# EAGLE design walrus (EAGLE 7.6.0)
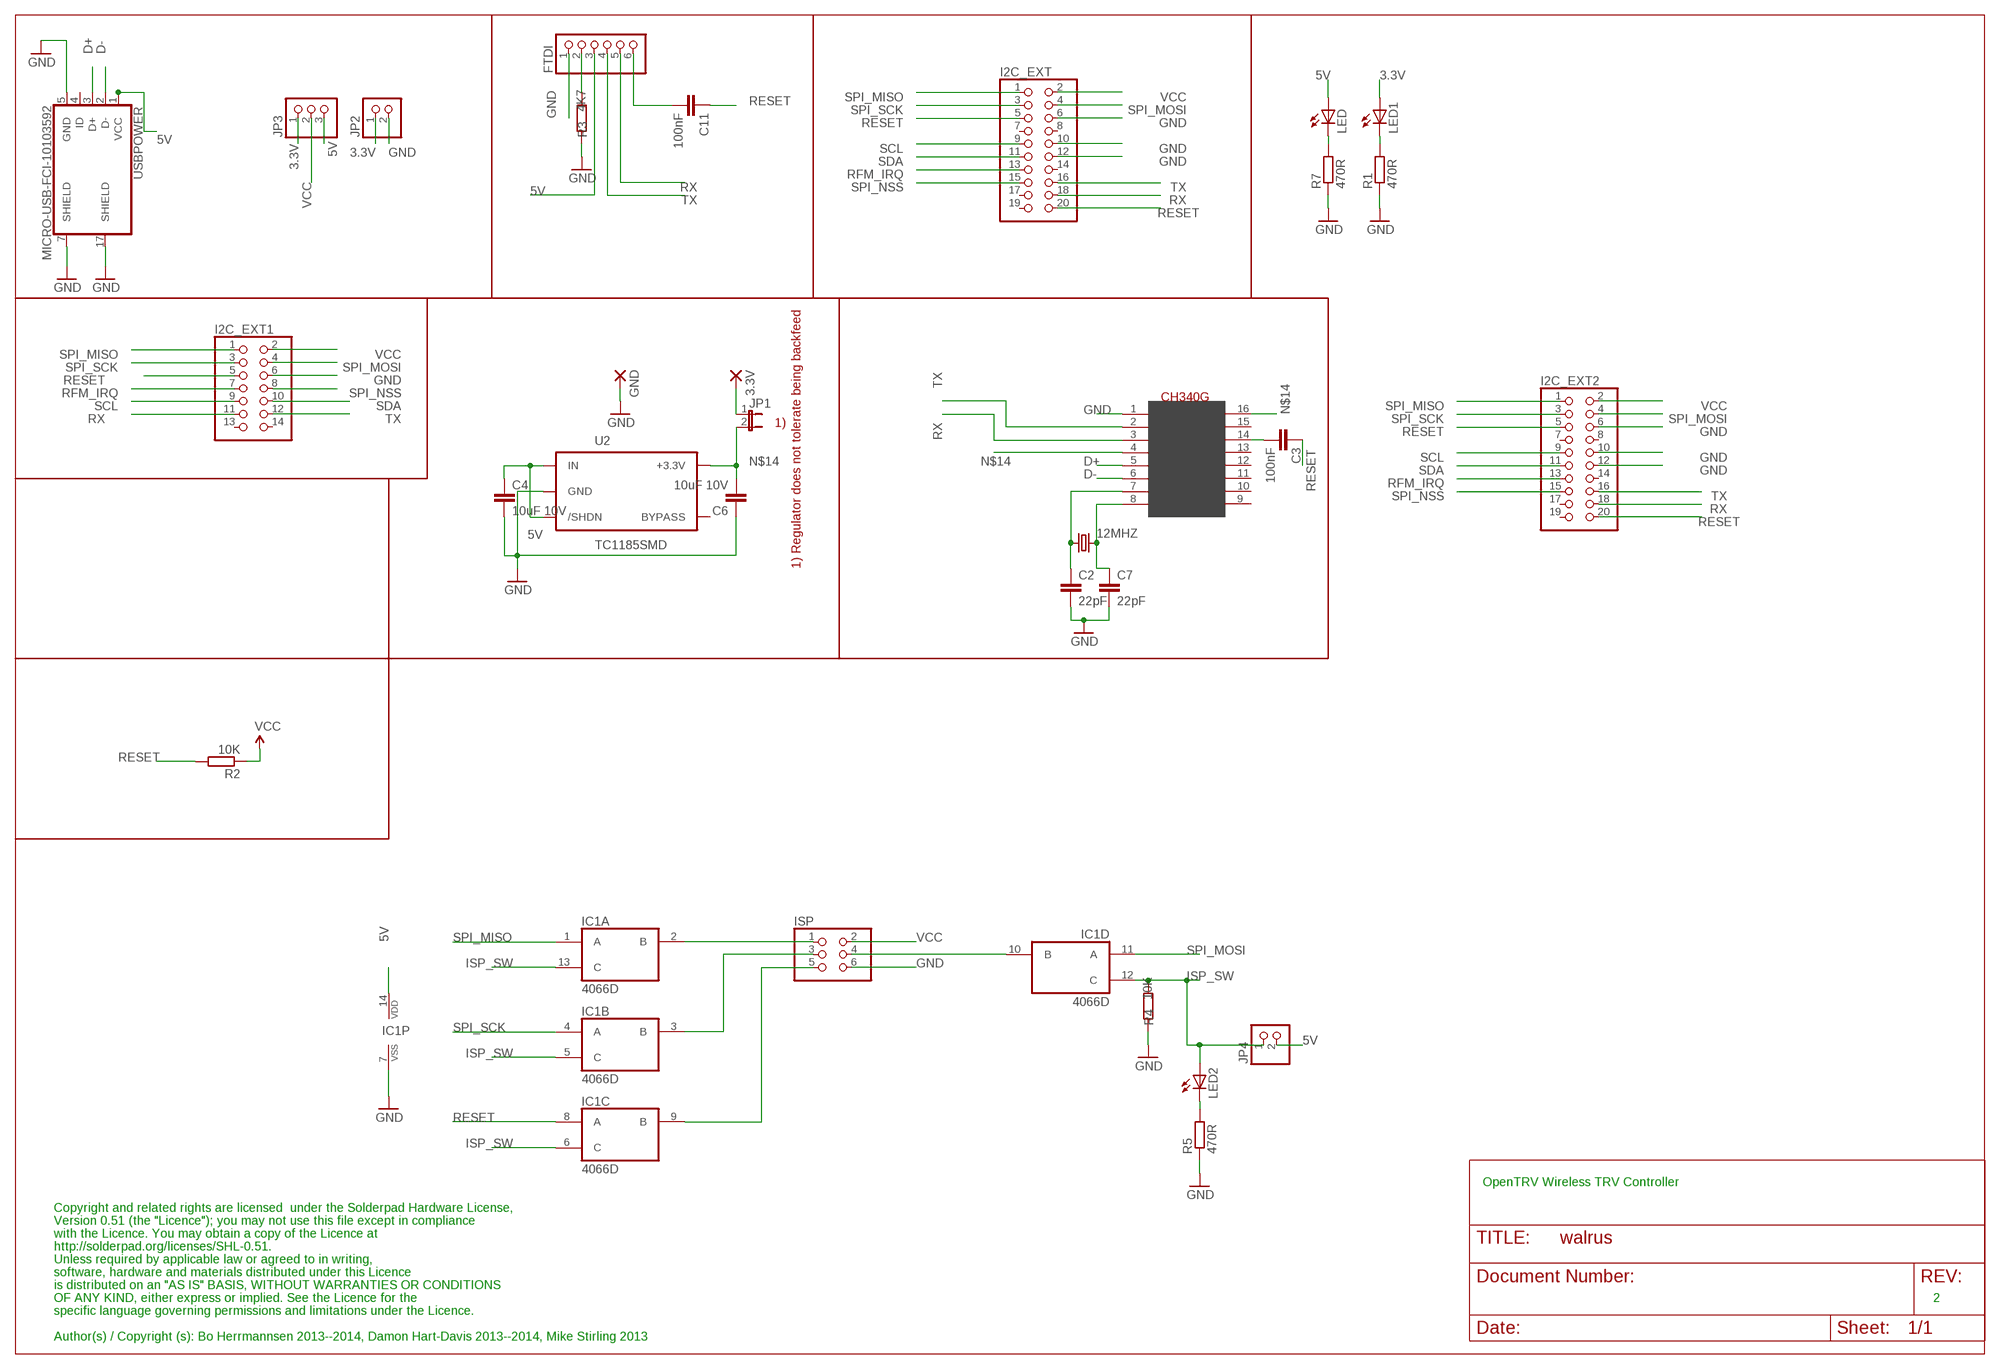
[diagram p0: schematic, sheet 1]

## Parts
3.3V  3,81/1,4  [3,81/1,4]
12MHZ  CRYSTALHC18U-V  [HC18U-V]
C2  22pF  C-EUC0603  [C0603]
C3  100nF  CAP0603-CAP  [0603-CAP]
C4  10uF 10V  CAP0603-CAP  [0603-CAP]
C6  10uF 10V  CAP0603-CAP  [0603-CAP]
C7  22pF  C-EUC0603  [C0603]
C11  100nF  CAP0603-CAP  [0603-CAP]
FTDI  PINHD-1X6/90  [1X06/90]
GND  3,81/1,4  [3,81/1,4]
I2C_EXT  PINHD-2X10  [2X10]
I2C_EXT1  PINHD-2X7  [2X07]
I2C_EXT2  PINHD-2X10  [2X10]
IC1  4066D  [SO14]
ISP  PINHD-2X3  [2X03]
JP1  JP1E  [JP1]
JP2  PINHD-1X2  [1X02]
JP3  PINHD-1X3  [1X03]
JP4  PINHD-1X2  [1X02]
LED  LEDCHIP-LED0603  [CHIP-LED0603]
LED1  LEDCHIP-LED0603  [CHIP-LED0603]
LED2  LEDCHIP-LED0603  [CHIP-LED0603]
R1  470R  R-EU_R0603  [R0603]
R2  10K  R-EU_R0603  [R0603]
R3  4K7  R-EU_R0603  [R0603]
R4  10K  R-EU_R0603  [R0603]
R5  470R  R-EU_R0603  [R0603]
R7  470R  R-EU_R0603  [R0603]
U2  TC1185SMD  [TC1185]
U$3  CH340G  [SOIC16]
USBPOWER  MICRO-USB-FCI-10103592  [MICRO-USB-FCI-10103592]

## Nets
3.3V [supply]: 3.3V.1(P) JP1.1 JP2.1 JP3.1 LED1.A
5V [supply]: C4.1 FTDI.3 IC1.14(P:VDD) JP3.3 JP4.2 LED.A U2.1(IN) U2.3(/SHDN) USBPOWER.1(VCC)
D+: U$3.5(D+) USBPOWER.3(D+)
D-: U$3.6(D-) USBPOWER.2(D-)
GND [supply]: C2.2 C4.2 C6.1 C7.2 FTDI.1 GND.1(P) I2C_EXT1.6 I2C_EXT2.6 I2C_EXT2.10 I2C_EXT2.12 I2C_EXT.6 I2C_EXT.10 I2C_EXT.12 IC1.7(P:VSS) ISP.6 JP2.2 R1.1 R3.1 R4.1 R5.1 R7.1 U2.2(GND) U$3.1(GND) USBPOWER.5(GND) USBPOWER.7(SHIELD) USBPOWER.17(SHIELD)
ISP_SW: IC1.5(B:C) IC1.6(C:C) IC1.12(D:C) IC1.13(A:C) JP4.1 LED2.A R4.2
N$1: C11.2 FTDI.6
N$3: C3.2 U$3.14(RTS)
N$5: FTDI.2 R3.2
N$6: IC1.2(A:B) ISP.1
N$7: LED1.C R1.2
N$8: 12MHZ.1 C2.1 U$3.7(XI)
N$11: IC1.3(B:B) ISP.3
N$13: LED.C R7.2
N$14 [supply]: C6.2 JP1.2 U2.5(+3.3V) U$3.4(V3) U$3.16(VCC)
N$15: 12MHZ.2 C7.1 U$3.8(XO)
N$17: IC1.9(C:B) ISP.5
N$20: IC1.10(D:B) ISP.4
N$21: LED2.C R5.2
RESET: C3.1 C11.1 I2C_EXT1.5 I2C_EXT2.5 I2C_EXT2.20 I2C_EXT.5 I2C_EXT.20 IC1.8(C:A) R2.2
RFM_IRQ: I2C_EXT1.7 I2C_EXT2.13 I2C_EXT.13
RX: FTDI.5 I2C_EXT1.11 I2C_EXT2.18 I2C_EXT.18 U$3.3(RX)
SCL: I2C_EXT1.9 I2C_EXT2.9 I2C_EXT.9
SDA: I2C_EXT1.10 I2C_EXT2.11 I2C_EXT.11
SPI_MISO: I2C_EXT1.1 I2C_EXT2.1 I2C_EXT.1 IC1.1(A:A)
SPI_MOSI: I2C_EXT1.4 I2C_EXT2.4 I2C_EXT.4 IC1.11(D:A)
SPI_NSS: I2C_EXT1.8 I2C_EXT2.15 I2C_EXT.15
SPI_SCK: I2C_EXT1.3 I2C_EXT2.3 I2C_EXT.3 IC1.4(B:A)
TX: FTDI.4 I2C_EXT1.12 I2C_EXT2.16 I2C_EXT.16 U$3.2(TX)
VCC [supply]: I2C_EXT1.2 I2C_EXT2.2 I2C_EXT.2 ISP.2 JP3.2 R2.1
Unconnected: I2C_EXT1.13 I2C_EXT1.14 I2C_EXT2.7 I2C_EXT2.8 I2C_EXT2.14 I2C_EXT2.17 I2C_EXT2.19 I2C_EXT.7 I2C_EXT.8 I2C_EXT.14 I2C_EXT.17 I2C_EXT.19 U2.4(BYPASS) U$3.9(CTS) U$3.10(DSR) U$3.11(RI) U$3.12(DCD) U$3.13(DTR) U$3.15(RS232) USBPOWER.4(ID)

## Notes on the sheet
- 1)
- 1) Regulator does not tolerate being backfeed
- OpenTRV Wireless TRV Controller
- Copyright and related rights are licensed  under the Solderpad Hardware License,
- Version 0.51 (the "Licence"); you may not use this file except in compliance
- with the Licence. You may obtain a copy of the Licence at
- http://solderpad.org/licenses/SHL-0.51.
- Unless required by applicable law or agreed to in writing,
- software, hardware and materials distributed under this Licence
- is distributed on an "AS IS" BASIS, WITHOUT WARRANTIES OR CONDITIONS
- OF ANY KIND, either express or implied. See the Licence for the | 2
- specific language governing permissions and limitations under the Licence.
- Author(s) / Copyright (s): Bo Herrmannsen 2013--2014, Damon Hart-Davis 2013--2014, Mike Stirling 2013

## Library data of the parts
3.3V GND = wirepad:3,81/1,4: THROUGH-HOLE PAD
12MHZ = crystal:CRYSTAL: CRYSTAL; OC_FARNELL: unknown; OC_NEWARK: unknown
C2 C7 = resistor:C-EU: CAPACITOR, European symbol
C3 C4 C6 C11 = SparkFun-Passives:CAP: Capacitor Standard 0603 ceramic capacitor, and 0.1" leaded capacitor.
FTDI = pinhead:PINHD-1X6: PIN HEADER
I2C_EXT I2C_EXT2 = pinhead:PINHD-2X10: PIN HEADER
I2C_EXT1 = pinhead:PINHD-2X7: PIN HEADER
IC1 = 40xx:4066: Quad bilateral ANALOG SWITCH
ISP = pinhead:PINHD-2X3: PIN HEADER
JP1 = jumper:JP1E: JUMPER
JP2 JP4 = pinhead:PINHD-1X2: PIN HEADER
JP3 = pinhead:PINHD-1X3: PIN HEADER
LED LED1 LED2 = led:LED: LED OSRAM: - CHIPLED LG R971, LG N971, LY N971, LG Q971, LY Q971, LO R971, LY R971 LH N974, LH R974 LS Q976, LO Q976, LY Q976 LO Q996 - Hyper CHIPLED LW Q18S LB Q993, LB Q99A, LB R99A - SideLED LS A670, LO A670, LY A670, LG A670, LP A670 LB A673, LV A673, LT A673, LW A673 LH A674 LY A675 LS A676, LA A676, LO A676, LY A676, LW A676 LS A679, LY A679, LG A679 - Hyper Micro SIDELED® LS Y876, LA Y876, LO Y876, LY Y876 LT Y87S - SmartLED LW L88C, LW L88S LB L89C, LB L89S, LG L890 LS L89K, LO L89K, LY L89K LS L896, LA L896, LO L896, LY L896 - TOPLED LS T670, LO T670, LY T670, LG T670, LP T670 LSG T670, LSP T670, LSY T670, LOP T670, LYG T670 LG T671, LOG T671, LSG T671 LB T673, LV T673, LT T673, LW T673 LH T674 LS T676, LA T676, LO T676, LY T676, LB T676, LH T676, LSB T676, LW T676 LB T67C, LV T67C, LT T67C, LS T67K, LO T67K, LY T67K, LW E67C LS E67B, LA E67B, LO E67B, LY E67B, LB E67C, LV E67C, LT E67C LW T67C LS T679, LY T679, LG T679 LS T770, LO T770, LY T770, LG T770, LP T770 LB T773, LV T773, LT T773, LW T773 LH T774 LS E675, LA E675, LY E675, LS T675 LS T776, LA T776, LO T776, LY T776, LB T776 LHGB T686 LT T68C, LB T68C - Hyper Mini TOPLED® LB M676 - Mini TOPLED Santana® LG M470 LS M47K, LO M47K, LY M47K Source: http://www.osram.convergy.de LUXEON: - LUMILED® LXK2-PW12-R00, LXK2-PW12-S00, LXK2-PW14-U00, LXK2-PW14-V00 LXK2-PM12-R00, LXK2-PM12-S00, LXK2-PM14-U00 LXK2-PE12-Q00, LXK2-PE12-R00, LXK2-PE12-S00, LXK2-PE14-T00, LXK2-PE14-U00 LXK2-PB12-K00, LXK2-PB12-L00, LXK2-PB12-M00, LXK2-PB14-N00, LXK2-PB14-P00, LXK2-PB14-Q00 LXK2-PR12-L00, LXK2-PR12-M00, LXK2-PR14-Q00, LXK2-PR14-R00 LXK2-PD12-Q00, LXK2-PD12-R00, LXK2-PD12-S00 LXK2-PH12-R00, LXK2-PH12-S00 LXK2-PL12-P00, LXK2-PL12-Q00, LXK2-PL12-R00 Source: www.luxeon.com KINGBRIGHT: KA-3528ASYC Source: www.kingbright.com
R1-R5 R7 = resistor:R-EU_: RESISTOR, European symbol
U2 = 3.3VREG:TC1185
U$3 = usb-serial:CH340G
USBPOWER = micro-usb-fci-10103592:MICRO-USB-FCI-10103592: Micro USB B Connector RS No: 714-2334 MRF No: 10103592-0001LF

## Net classes
0 default: width 0.203 mm
1 supply: width 0.406 mm, clearance 0.203 mm

## Board
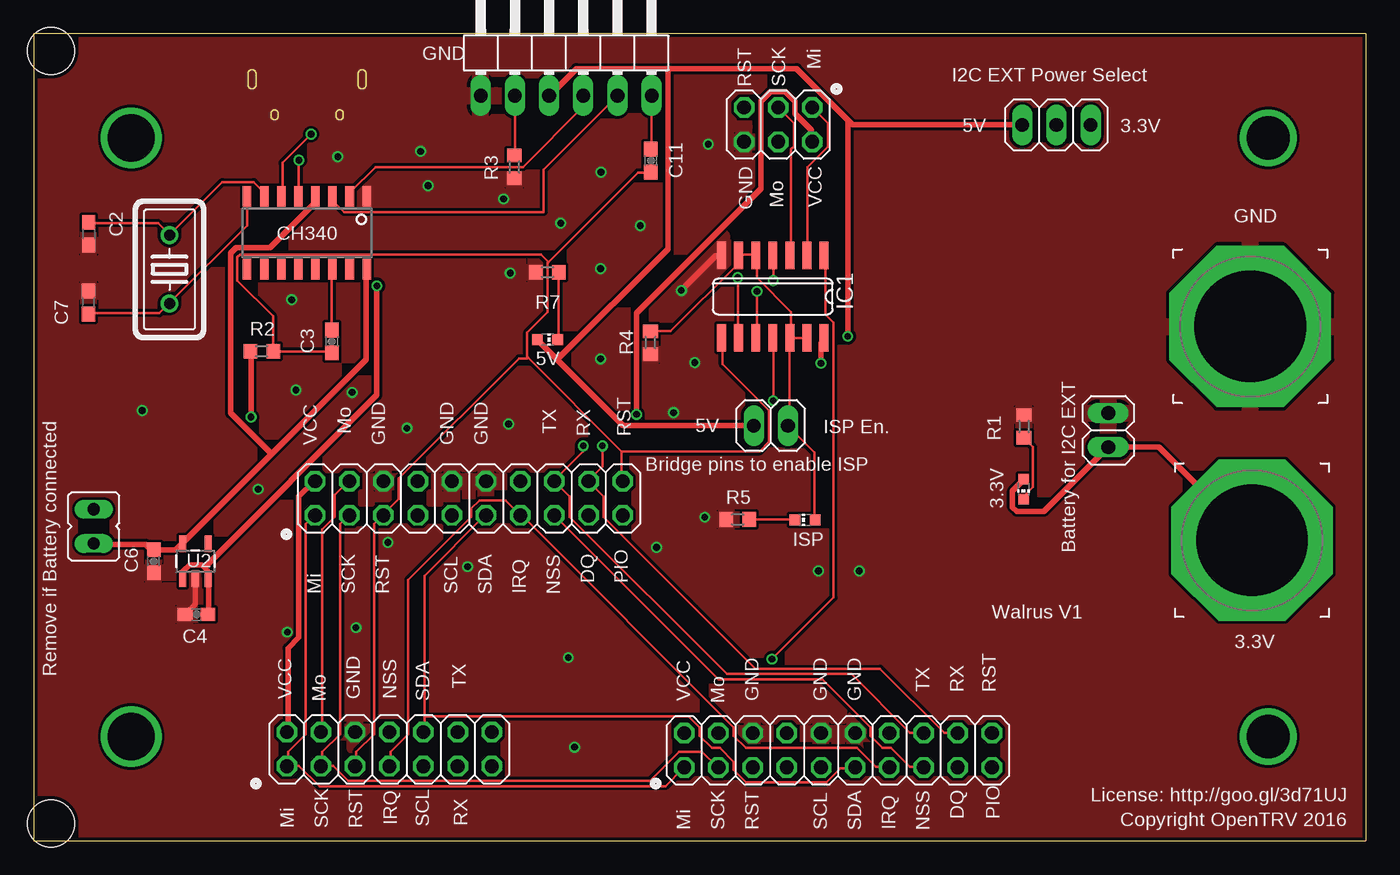
[diagram p1: board, top side]
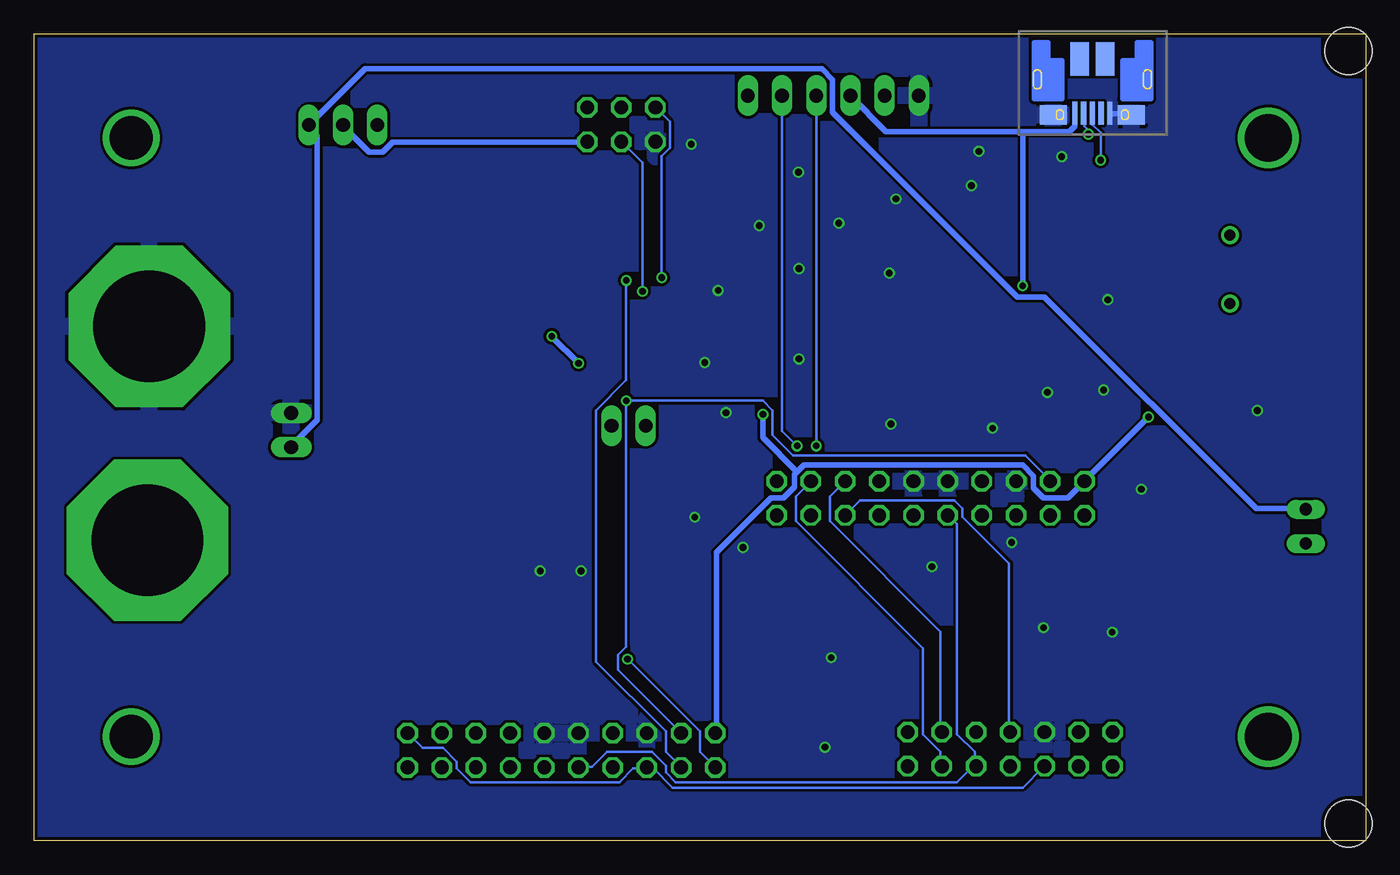
[diagram p2: board, bottom side, seen from below]

Size 99 x 60 mm. Coordinates in mm from the lower left corner, seen from the top.
Outline: 0,0 99,0 99,60 0,60 0,0
Copper layers (1*16): Top 0.035mm / dielectric 1.5mm / Bottom 0.035mm
Design rules "PMServicesStd *": minimum track width 8mil, minimum drill 0.5mm, track to track 8mil, track to pad 8mil, pad to pad 8mil, via to via 8mil, smd to smd 0mil, copper to edge 10mil, drill to drill 10mil, minimum pad ring 10mil, minimum via ring 6mil, stop-mask expansion 2mil, vias tented up to drill 100mil, thermal gap 10mil
Holes 3.5 mm at 1.3,58.7 1.3,1.3

### Footprints (pad centres in the part's own frame; a part is rotated, then mirrored left to right if it is on the bottom)
3,81/1,4 = drill 8.3 pad 12 octagon: 1 0,0
HC18U-V = drill 0.813: 1 -2.54,0; 2 2.54,0
C0603 = smd 1.1 x 1: 1 -0.85,0; 2 0.85,0
0603-CAP = smd 1.1 x 1: 1 -0.85,0; 2 0.85,0
1X06/90 = drill 1.016 long: 1 -6.35,-3.81; 2 -3.81,-3.81; 3 -1.27,-3.81; 4 1.27,-3.81; 5 3.81,-3.81; 6 6.35,-3.81
2X10 = drill 1.016 octagon: 1 -11.43,-1.27; 2 -11.43,1.27; 3 -8.89,-1.27; 4 -8.89,1.27; 5 -6.35,-1.27; 6 -6.35,1.27; 7 -3.81,-1.27; 8 -3.81,1.27; 9 -1.27,-1.27; 10 -1.27,1.27; 11 1.27,-1.27; 12 1.27,1.27; 13 3.81,-1.27; 14 3.81,1.27; 15 6.35,-1.27; 16 6.35,1.27; 17 8.89,-1.27; 18 8.89,1.27; 19 11.43,-1.27; 20 11.43,1.27
2X07 = drill 1.016 octagon: 1 -7.62,-1.27; 2 -7.62,1.27; 3 -5.08,-1.27; 4 -5.08,1.27; 5 -2.54,-1.27; 6 -2.54,1.27; 7 0,-1.27; 8 0,1.27; 9 2.54,-1.27; 10 2.54,1.27; 11 5.08,-1.27; 12 5.08,1.27; 13 7.62,-1.27; 14 7.62,1.27
SO14 = smd 0.66 x 2.032: 1 -3.81,-3.073; 2 -2.54,-3.073; 3 -1.27,-3.073; 4 0,-3.073; 5 1.27,-3.073; 6 2.54,-3.073; 7 3.81,-3.073; 8 3.81,3.073; 9 2.54,3.073; 10 1.27,3.073; 11 0,3.073; 12 -1.27,3.073; 13 -2.54,3.073; 14 -3.81,3.073
2X03 = drill 1.016 octagon: 1 -2.54,-1.27; 2 -2.54,1.27; 3 0,-1.27; 4 0,1.27; 5 2.54,-1.27; 6 2.54,1.27
JP1 = drill 0.914 long: 1 0,-1.27; 2 0,1.27
1X02 = drill 1.016 long: 1 -1.27,0; 2 1.27,0
1X03 = drill 1.016 long: 1 -2.54,0; 2 0,0; 3 2.54,0
CHIP-LED0603 = smd 0.8 x 0.8: A 0,-0.75; C 0,0.75
R0603 = smd 1 x 1.1: 1 -0.85,0; 2 0.85,0
TC1185 = smd 0.55 x 1.2: 1 -0.95,-1.3; 2 0,-1.3; 3 0.95,-1.3; 4 0.95,1.3; 5 -0.95,1.3
SOIC16 = smd 0.635 x 1.524: 1 -4.445,-2.695; 2 -3.175,-2.695; 3 -1.905,-2.695; 4 -0.635,-2.695; 5 0.635,-2.695; 6 1.905,-2.695; 7 3.175,-2.695; 8 4.445,-2.695; 9 4.445,2.695; 10 3.175,2.695; 11 1.905,2.695; 12 0.635,2.695; 13 -0.635,2.695; 14 -1.905,2.695; 15 -3.175,2.695; 16 -4.445,2.695
MICRO-USB-FCI-10103592 = smd 0.4 x 1.71: 1 3.84,2.51; 2 3.19,2.51; 3 2.54,2.51; 4 1.89,2.51; 5 1.24,2.51 | smd 2 x 1.46: 7 -0.36,2.64; 17 5.44,2.64 | smd 1.375 x 2.5: 11 1.603,-1.52; 12 3.478,-1.52

### Placement (x,y rotation side)
3.3V  90.54,22.34 0 top
12MHZ  10.1,42.47 270 top
C2  4.09,45.12 270 top
C3  22.15,37.12 90 top
C4  12.1,16.83 180 top
C6  8.92,20.79 90 top
C7  4.09,40.01 90 top
C11  45.87,50.56 90 top
FTDI  39.57,59.2 0 top
GND  90.41,38.24 0 top
I2C_EXT  59.78,6.74 0 top
I2C_EXT1  26.43,6.82 0 top
I2C_EXT2  32.35,25.46 0 top
IC1  54.93,40.45 180 top
ISP  55.33,53.24 180 top
JP1  4.47,23.37 180 top
JP2  79.86,30.53 90 top
JP3  76.01,53.21 180 top
JP4  54.78,30.87 180 top
LED  38.18,37.26 270 top
LED1  73.56,26.14 180 top
LED2  57.33,23.86 90 top
R1  73.59,30.8 270 top
R2  16.95,36.39 0 top
R3  35.72,50.08 90 top
R4  45.83,37.03 90 top
R5  52.32,23.89 0 top
R7  38.18,42.26 0 top
U2  12.02,20.79 0 top
U$3  20.31,45.19 180 top
USBPOWER  17.79,56.59 180 bottom

### Tracks (layer width: path | path; a pad name or v marks a point on that pad's centre or on a via)
3.3V
  Top 0.406: LED1.A 73.56,26.82 72.75,26.01 72.75,24.79 73.05,24.49 75.08,24.49 JP2.1 80.06,29.26 83.62,29.26 90.53,22.35 3.3V.1
  Bottom 0.406: JP1.1 4.47,24.69 8.13,24.69 23.88,40.44 25.91,40.44 39.62,54.15 39.62,56.59 40.44,57.4 74.37,57.4 78.54,53.24 JP3.1 78.54,53.03 77.93,52.43 77.93,31.29 79.86,29.36 JP2.1
5V  (via drill 0.5)
  Top 0.406: 38.91,35.76 43.79,30.89 53.44,30.89 JP4.2 | 38.91,35.76 37.49,37.19 LED.A | C4.1 13.01,16.87 13.01,19.41 U2.3 12.9,19.61 12.9,20.12 12.7,20.32 | 12.7,20.32 12.5,20.52 11.58,20.52 11.07,20.02 11.07,19.51 U2.1 | 12.7,20.32 25.5,33.12 v25.5,41.25 | 60.55,53.55 56.69,57.4 47.14,57.4 | 60.55,53.55 60.86,53.24 73.46,53.24 JP3.3 | 47.14,57.4 40.34,57.4 38.41,55.47 FTDI.3 | 38.91,35.76 47.14,43.99 47.14,57.4 | v58.5,35.5 58.5,37 IC1.14 | v60.5,37.5 60.5,53.5 60.55,53.55
  Bottom 0.406: 25.5,52.73 35.66,52.73 38.3,55.37 FTDI.3 | 25.5,52.73 22.05,52.73 21.64,53.14 21.64,54.05 USBPOWER.1 | 25.5,52.73 v25.5,41.25 | v60.5,37.5 v58.5,35.5
D+  (via drill 0.5)
  Top 0.203: v19.71,50.6 19.71,47.95 U$3.5
  Bottom 0.203: v19.71,50.6 19.71,52.63 20.32,53.24 20.32,54.05 USBPOWER.3
D-  (via drill 0.5)
  Top 0.203: v20.62,52.53 18.49,50.39 18.49,47.95 U$3.6
  Bottom 0.203: v20.62,52.53 20.62,52.83 20.93,53.14 20.93,54.05 USBPOWER.2
GND  (via drill 0.5)
  Top 0.406: U2.2 11.99,19.41 11.99,17.58 11.28,16.87 C4.2 | IC1.7 51.1,43.48 50.7,43.48 48.16,40.95 v48.13,40.91 | I2C_EXT2.10 31.5,26.72 31.5,26.73
  Bottom 0.406: USBPOWER.5 19,54.05 17.48,54.05 USBPOWER.7
  other vias: 8.07,31.98 22.6,50.86 29.31,48.7 28.75,51.26 34.91,47.71 35.41,42.2 39.17,45.91 42.17,49.7 42.12,42.53 42.12,35.82 45.08,45.72 49.13,35.55 47.56,31.83 49.87,24.06 58.32,20.06 61.36,20.06 23.95,15.85 16.68,26.14 23.66,33.33 27.74,30.67 35.29,30.98 50.13,51.79 18.85,15.52 46.29,21.81 39.73,13.62 40.19,6.96 32.24,20.38 26.32,22.18 19.17,40.22 19.49,33.5
  pour Bottom: 0,0 99,0 99,60 0,60
  pour Top: 0,60 0,0 99,0 99,60
ISP_SW
  Top 0.203: R4.2 45.92,37.9 47.35,37.9 52.32,42.88 52.32,43.48 IC1.6 52.43,43.59 53.65,43.59 IC1.5 53.75,43.48 53.75,41.86 56.29,39.32 56.29,37.49 IC1.12 | IC1.12 56.29,37.39 57.4,37.39 IC1.13 | LED2.A 58.01,23.88 58.01,28.85 56.08,30.79 JP4.1 56.19,30.79 56.19,37.29 IC1.12
N$1
  Top 0.203: C11.2 45.92,51.51 45.92,55.37 FTDI.6
N$3
  Top 0.203: C3.2 22.15,38 22.15,42.47 U$3.14
N$4  (via drill 3.5)
  other vias: 7.25,52.25
N$5
  Top 0.203: R3.2 35.76,51 35.76,55.37 FTDI.2
N$6
  Top 0.203: IC1.2 57.51,43.59 57.51,50.09 59.03,51.61 59.03,53.34 57.91,54.46 ISP.1
N$7
  Top 0.203: LED1.C 73.66,25.4 73.66,25.7 74.27,26.31 74.27,29.26 73.66,29.87 R1.2
N$8
  Top 0.203: C2.1 4.17,45.92 9.25,45.92 10.06,45.11 12MHZ.1 10.16,45.11 14.02,48.97 16.36,48.97 17.07,48.26 17.07,47.95 U$3.7
N$11
  Top 0.203: IC1.3 56.29,43.59 56.29,51.41 56.49,51.61 56.49,53.34 55.37,54.46 ISP.3
N$12  (via drill 3.2)
  other vias: 91.75,7.75
N$13
  Top 0.203: LED.C 39.01,37.29 39.01,42.16 R7.2
N$14
  Top 0.406: 17.68,28.75 11.18,22.25 U2.5 10.97,22.05 10.57,21.64 8.94,21.64 C6.2 8.74,21.64 8.33,22.05 4.47,22.05 JP1.2 | 17.68,28.75 24.69,35.76 24.69,42.47 U$3.16 | 17.68,28.75 14.63,31.8 14.63,43.69 15.04,44.09 17.58,44.09 20.93,47.45 20.93,47.85 U$3.4
N$15
  Top 0.203: C7.1 4.17,39.22 9.35,39.22 10.06,39.93 12MHZ.2 10.16,40.03 15.85,45.72 15.85,47.85 U$3.8
N$17  (via drill 0.5)
  Top 0.203: v52.32,41.86 52.32,37.39 IC1.9
  Bottom 0.203: v52.32,41.86 52.32,50.9 51.71,51.51 51.71,53.44 52.73,54.46 ISP.5
N$19  (via drill 3.2)
  other vias: 91.75,52.25
N$20  (via drill 0.5)
  Top 0.203: v53.75,40.84 53.75,37.39 IC1.10
  Bottom 0.203: v53.75,40.84 53.75,50.39 55.27,51.92 ISP.4
N$21
  Top 0.203: LED2.C 56.49,23.88 53.24,23.88 R5.2
N$22  (via drill 3.5)
  other vias: 7.25,7.75
RESET
  Top 0.203: C3.1 22.15,36.37 17.88,36.37 R2.2 17.78,36.47 17.78,39.01 15.14,41.66 15.14,43.38 15.34,43.59 37.69,43.59 38.25,43.03 | 38.25,43.03 38.2,42.98 38.2,39.32 36.68,37.8 36.68,35.97 36.73,35.92 | 38.25,43.03 44.91,49.68 45.82,49.68 C11.1 | 43.69,28.96 36.73,35.92 | 43.69,28.96 43.69,26.82 I2C_EXT2.20 | 43.69,28.96 53.95,28.96 54.66,29.67 54.66,32 51.21,35.46 51.21,37.29 IC1.8 | I2C_EXT1.5 23.98,5.59 23.98,6.6 25.3,7.92 25.3,23.57 25.91,24.18 I2C_EXT2.5 26.01,24.28 27.13,25.4 27.13,26.92 36.07,35.87 36.68,35.87 36.73,35.92
  Bottom 0.203: I2C_EXT.20 71.12,7.92 70.1,6.91 68.58,6.91 67.56,5.89 67.56,5.38 66.55,4.37 55.47,4.37 54.46,5.38 53.44,5.38 I2C_EXT.5 53.34,5.38 52.93,5.38 51.51,3.96 25.5,3.96 23.98,5.49 I2C_EXT1.5
RFM_IRQ
  Top 0.203: I2C_EXT1.7 26.52,5.59 26.52,6.6 27.84,7.92 27.84,19.41 32.51,24.08 32.51,24.69 33.12,25.3 35.05,25.3 36.07,24.28 I2C_EXT2.13 36.17,24.28 52.02,8.43 52.02,7.82 52.93,6.91 61.16,6.91 62.59,5.49 63.5,5.49 I2C_EXT.13
RX  (via drill 0.5)
  Top 0.203: U$3.3 22.25,47.85 22.25,47.55 23.06,46.74 37.9,46.74 37.9,49.89 43.38,55.37 FTDI.5 | I2C_EXT.18 68.58,8.03 67.67,8.03 62.89,12.8 53.65,12.8 42.37,24.08 42.37,25.6 I2C_EXT2.18 41.25,26.82 42.27,27.84 v42.27,29.36
  Bottom 0.203: I2C_EXT1.11 31.6,5.59 31.6,6.6 32.92,7.92 32.92,14.33 42.37,23.77 42.37,25.6 I2C_EXT2.18 | v42.27,29.36 43.38,30.48 43.38,55.37 FTDI.5
SCL
  Bottom 0.203: I2C_EXT2.9 30.99,24.18 30.38,23.57 30.38,7.92 29.06,6.6 29.06,5.59 I2C_EXT1.9 29.16,5.59 30.38,4.37 51.31,4.37 52.02,5.08 52.02,5.59 53.03,6.6 56.39,6.6 57.51,5.49 58.42,5.49 I2C_EXT.9
SDA
  Top 0.203: 29.06,9.25 29.06,19.71 33.53,24.18 I2C_EXT2.11 | 29.06,9.25 29.06,8.13 I2C_EXT1.10 | 29.06,9.25 48.67,9.25 49.48,8.43 49.48,7.82 50.39,6.91 51,6.91 52.02,5.89 52.02,5.28 52.93,4.37 58.93,4.37 59.94,5.38 60.96,5.38 I2C_EXT.11
SPI_MISO  (via drill 0.5)
  Top 0.203: I2C_EXT2.1 20.83,24.18 20.22,23.57 20.22,7.92 18.9,6.6 18.9,5.59 I2C_EXT1.1 19,5.59 19.71,5.59 21.23,4.06 46.94,4.06 48.26,5.38 I2C_EXT.1 | v54.86,13.51 59.44,18.09 59.44,38.51 58.83,39.12 58.83,43.48 IC1.1
  Bottom 0.203: v54.86,13.51 49.48,8.13 49.48,6.6 48.36,5.49 I2C_EXT.1
SPI_MOSI  (via drill 0.5)
  Top 0.203: I2C_EXT1.4 21.44,8.13 21.44,23.16 22.35,24.08 22.35,25.7 23.37,26.72 I2C_EXT2.4 | v54.97,32.72 54.97,37.29 IC1.11
  Bottom 0.203: I2C_EXT.4 50.9,8.03 55.58,12.7 55.58,13.82 54.97,14.43 v54.97,32.72 44.81,32.72 44.09,32 44.09,30.18 42.57,28.65 25.3,28.65 23.47,26.82 I2C_EXT2.4
SPI_NSS
  Top 0.203: I2C_EXT.15 66.04,5.49 65.13,5.49 63.7,6.91 63.09,6.91 62.18,7.82 62.18,8.43 58.62,11.99 50.9,11.99 I2C_EXT2.15
  Bottom 0.203: I2C_EXT1.8 26.52,8.13 26.52,20.62 29.97,24.08 29.97,24.69 30.58,25.3 37.59,25.3 38.61,24.28 I2C_EXT2.15
SPI_SCK  (via drill 0.5)
  Top 0.203: I2C_EXT2.3 23.37,24.18 22.76,23.57 22.76,7.92 21.44,6.6 21.44,5.59 I2C_EXT1.3 21.54,5.59 22.25,5.59 23.37,4.47 45.82,4.47 47.95,6.6 49.68,6.6 50.8,5.49 I2C_EXT.3 | v54.97,41.66 54.97,43.48 IC1.4
  Bottom 0.203: v54.97,41.66 54.97,34.24 57.2,32 57.2,13.31 52.02,8.13 52.02,6.6 50.9,5.49 I2C_EXT.3
TX  (via drill 0.5)
  Top 0.203: U$3.2 23.57,47.95 23.57,48.26 25.4,50.09 36.37,50.09 40.84,54.56 40.84,55.37 FTDI.4 | I2C_EXT.16 66.04,8.03 65.13,8.03 60.76,12.39 51.51,12.39 39.83,24.08 39.83,25.6 I2C_EXT2.16 38.71,26.82 40.84,28.96 v40.84,29.36
  Bottom 0.203: I2C_EXT1.12 31.6,8.13 31.6,15.54 39.83,23.77 39.83,25.6 I2C_EXT2.16 | v40.84,29.36 40.84,55.37 FTDI.4
VCC  (via drill 0.5)
  Top 0.406: v16.15,31.5 16.15,36.37 R2.1 | v44.81,31.7 44.81,39.22 54.05,48.46 54.05,54.97 54.76,55.68 55.88,55.68 56.59,54.97 56.59,54.05 57.81,52.83 57.81,52.02 ISP.2 | I2C_EXT1.2 18.9,8.13 18.9,14.33 19.71,15.14 19.71,25.6 20.83,26.72 I2C_EXT2.2
  Bottom 0.406: ISP.2 57.91,51.92 72.34,51.92 73.05,51.21 74.07,51.21 76,53.14 JP3.2 | v16.15,31.5 20.83,26.82 I2C_EXT2.2 21.03,26.62 22.15,25.5 23.98,25.5 24.69,26.21 24.69,27.13 25.5,27.94 41.76,27.94 42.27,27.43 | 42.27,27.43 42.47,27.23 42.47,26.31 43.28,25.5 44.2,25.5 48.26,21.44 48.26,8.03 I2C_EXT.2 | v44.81,31.7 44.81,29.97 42.27,27.43

### Text on the board
tNames: RST | SCK | Mi | GND | I2C EXT Power Select | 5V | 3.3V | GND | VCC | Mo | CH340 | 5V | Mo | TX | RX | RST | 5V | ISP En. | VCC | GND | GND | GND | 3.3V | Bridge pins to enable ISP | ISP | Battery for I2C EXT | DQ | PIO | Mi | SCK | RST | SCL | SDA | IRQ | NSS | Walrus V1 | Remove if Battery connected | VCC | GND | NSS | TX | TX | RX | RST | Mo | SDA | VCC | Mo | GND | GND | GND | License: http://goo.gl/3d71UJ | DQ | PIO | Copyright OpenTRV 2016 | Mi | SCK | RST | IRQ | SCL | RX | Mi | SCK | RST | SCL | SDA | IRQ | NSS